# Altium schematic sheet core.SchDoc
size A4
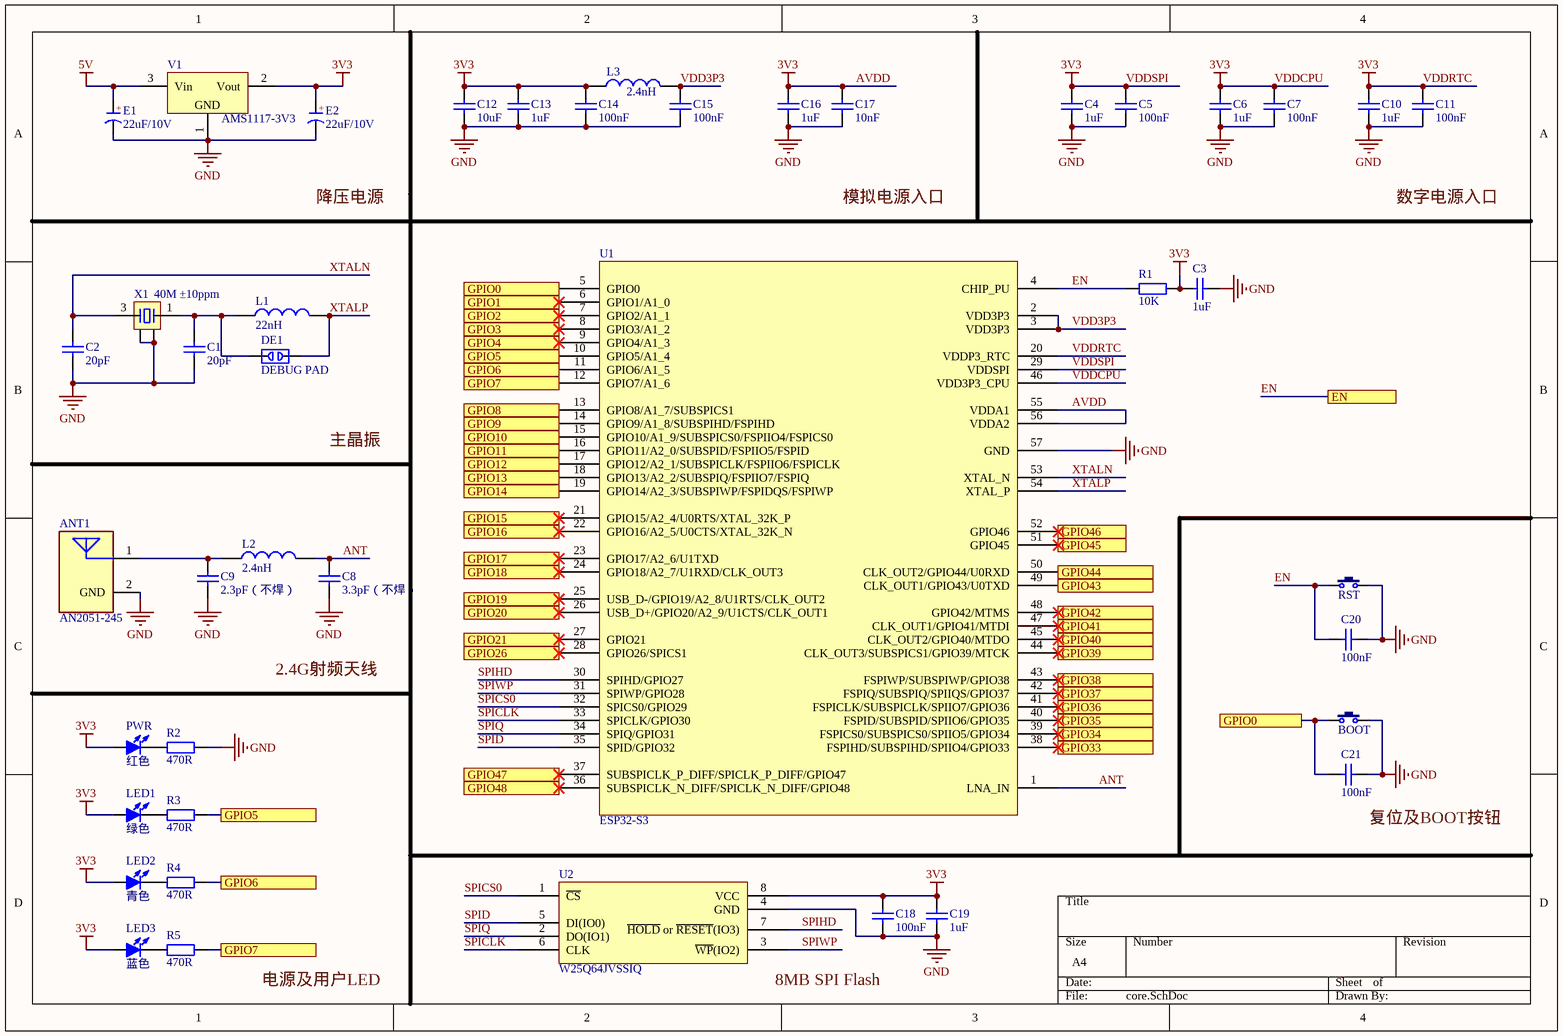
[diagram p0: core.SchDoc]

## Parts
ANT1  AN2051-245  [SMD-2051]
BOOT  3x6x5  [TSW SMD-3*6*2.5]  (value not drawn)
C1  20pF  [C 0603_L]
C2  20pF  [C 0603_L]
C3  1uF  [C 0603_L]
C4  1uF  [C 0603_L]
C5  100nF  [C 0603_L]
C6  1uF  [C 0603_L]
C7  100nF  [C 0603_L]
C8  3.3pF（不焊）  [C 0402_L]
C9  2.3pF（不焊）  [C 0402_L]
C10  1uF  [C 0603_L]
C11  100nF  [C 0603_L]
C12  10uF  [C 0603_L]
C13  1uF  [C 0603_L]
C14  100nF  [C 0603_L]
C15  100nF  [C 0603_L]
C16  1uF  [C 0603_L]
C17  10nF  [C 0603_L]
C18  100nF  [C 0603_L]
C19  1uF  [C 0603_L]
C20  100nF  [C 0603_L]
C21  100nF  [C 0603_L]
DE1  DEBUG PAD  [DEBUG_A]
E1  22uF/10V  [CD A(3216)]
E2  22uF/10V  [CD A(3216)]
L1  22nH  [L 0603]
L2  2.4nH  [L 0402]
L3  2.4nH  [L 0402]
LED1  绿色  [LED 0603B]
LED2  青色  [LED 0603B]
LED3  蓝色  [LED 0603B]
PWR  红色  [LED 0603B]
R1  10K  [R 0603_L]
R2  470R  [R 0603_L]
R3  470R  [R 0603_L]
R4  470R  [R 0603_L]
R5  470R  [R 0603_L]
RST  3x6x5  [TSW SMD-3*6*2.5]  (value not drawn)
U1  ESP32-S3  [QFN56 7x7]
U2  W25Q64JVSSIQ  [SOIC-8W]
V1  AMS1117-3V3  [SOT223_L]
X1  40M ±10ppm  [OSC 2025-4P]

## Ports
EN, GPIO0, GPIO1, GPIO2, GPIO3, GPIO4, GPIO5, GPIO6, GPIO7, GPIO8, GPIO9, GPIO10, GPIO11, GPIO12, GPIO13, GPIO14, GPIO15, GPIO16, GPIO17, GPIO18, GPIO19, GPIO20, GPIO21, GPIO26, GPIO33, GPIO34, GPIO35, GPIO36, GPIO37, GPIO38, GPIO39, GPIO40, GPIO41, GPIO42, GPIO43, GPIO44, GPIO45, GPIO46, GPIO47, GPIO48

## Nets
5V: E1.1(A) V1.3(Vin)
AVDD: C3.2 C4.1 C5.1 C6.1 C7.1 C10.1 C11.1 C12.1 C13.1 C14.1 C16.1 C17.1 C18.1 C19.1 E2.1(A) L3.1 LED1.1(A) LED2.1(A) LED3.1(A) PWR.1(A) R1.2 U1.20(VDDP3_RTC) U1.29(VDDSPI) U1.46(VDD3P3_CPU) U1.55(VDDA1) U1.56(VDDA2) U2.8(VCC) V1.2(Vout)  [also labelled 3V3, VDDCPU, VDDRTC, VDDSPI]
GND: ANT1.2(GND) BOOT.2 C1.1 C2.1 C3.1 C4.2 C5.2 C6.2 C7.2 C8.1 C9.1 C10.2 C11.2 C12.2 C13.2 C14.2 C15.2 C16.2 C17.2 C18.2 C19.2 C20.1 C21.1 E1.2(K) E2.2(K) R2.2 RST.2 U1.57(GND) U2.4(GND) V1.1(GND) X1.2 X1.4
ANT: C8.2 L2.1 U1.1(LNA_IN)
EN: C20.2 R1.1 RST.1 U1.4(CHIP_PU) ; port EN
GPIO0: BOOT.1 C21.2 U1.5(GPIO0) ; port GPIO0
GPIO1: U1.6(GPIO1/A1_0) ; port GPIO1
GPIO2: U1.7(GPIO2/A1_1) ; port GPIO2
GPIO3: U1.8(GPIO3/A1_2) ; port GPIO3
GPIO4: U1.9(GPIO4/A1_3) ; port GPIO4
GPIO5: R3.2 U1.10(GPIO5/A1_4) ; port GPIO5
GPIO6: R4.2 U1.11(GPIO6/A1_5) ; port GPIO6
GPIO7: R5.2 U1.12(GPIO7/A1_6) ; port GPIO7
GPIO8: U1.13(GPIO8/A1_7/SUBSPICS1) ; port GPIO8
GPIO9: U1.14(GPIO9/A1_8/SUBSPIHD/FSPIHD) ; port GPIO9
GPIO10: U1.15(GPIO10/A1_9/SUBSPICS0/FSPIIO4/FSPICS0) ; port GPIO10
GPIO11: U1.16(GPIO11/A2_0/SUBSPID/FSPIIO5/FSPID) ; port GPIO11
GPIO12: U1.17(GPIO12/A2_1/SUBSPICLK/FSPIIO6/FSPICLK) ; port GPIO12
GPIO13: U1.18(GPIO13/A2_2/SUBSPIQ/FSPIIO7/FSPIQ) ; port GPIO13
GPIO14: U1.19(GPIO14/A2_3/SUBSPIWP/FSPIDQS/FSPIWP) ; port GPIO14
GPIO15: U1.21(GPIO15/A2_4/U0RTS/XTAL_32K_P) ; port GPIO15
GPIO16: U1.22(GPIO16/A2_5/U0CTS/XTAL_32K_N) ; port GPIO16
GPIO17: U1.23(GPIO17/A2_6/U1TXD) ; port GPIO17
GPIO18: U1.24(GPIO18/A2_7/U1RXD/CLK_OUT3) ; port GPIO18
GPIO19: U1.25(USB_D-/GPIO19/A2_8/U1RTS/CLK_OUT2) ; port GPIO19
GPIO20: U1.26(USB_D+/GPIO20/A2_9/U1CTS/CLK_OUT1) ; port GPIO20
GPIO21: U1.27(GPIO21) ; port GPIO21
GPIO26: U1.28(GPIO26/SPICS1) ; port GPIO26
GPIO33: U1.38(FSPIHD/SUBSPIHD/SPIIO4/GPIO33) ; port GPIO33
GPIO34: U1.39(FSPICS0/SUBSPICS0/SPIIO5/GPIO34) ; port GPIO34
GPIO35: U1.40(FSPID/SUBSPID/SPIIO6/GPIO35) ; port GPIO35
GPIO36: U1.41(FSPICLK/SUBSPICLK/SPIIO7/GPIO36) ; port GPIO36
GPIO37: U1.42(FSPIQ/SUBSPIQ/SPIIQS/GPIO37) ; port GPIO37
GPIO38: U1.43(FSPIWP/SUBSPIWP/GPIO38) ; port GPIO38
GPIO39: U1.44(CLK_OUT3/SUBSPICS1/GPIO39/MTCK) ; port GPIO39
GPIO40: U1.45(CLK_OUT2/GPIO40/MTDO) ; port GPIO40
GPIO41: U1.47(CLK_OUT1/GPIO41/MTDI) ; port GPIO41
GPIO42: U1.48(GPIO42/MTMS) ; port GPIO42
GPIO43: U1.49(CLK_OUT1/GPIO43/U0TXD) ; port GPIO43
GPIO44: U1.50(CLK_OUT2/GPIO44/U0RXD) ; port GPIO44
GPIO45: U1.51(GPIO45) ; port GPIO45
GPIO46: U1.52(GPIO46) ; port GPIO46
GPIO47: U1.37(SUBSPICLK_P_DIFF/SPICLK_P_DIFF/GPIO47) ; port GPIO47
GPIO48: U1.36(SUBSPICLK_N_DIFF/SPICLK_N_DIFF/GPIO48) ; port GPIO48
SPICLK: U1.33(SPICLK/GPIO30) U2.6(CLK)
SPICS0: U1.32(SPICS0/GPIO29) U2.1(~{CS})
SPID: U1.35(SPID/GPIO32) U2.5(DI(IO0))
SPIHD: U1.30(SPIHD/GPIO27) U2.7(~{HOLD}_or_~{RESET}(IO3))
SPIQ: U1.34(SPIQ/GPIO31) U2.2(DO(IO1))
SPIWP: U1.31(SPIWP/GPIO28) U2.3(~{WP}(IO2))
VDD3P3: C15.1 L3.2 U1.2(VDD3P3) U1.3(VDD3P3)
XTALN: C2.2 U1.53(XTAL_N) X1.3
XTALP: DE1.1 L1.1 U1.54(XTAL_P)
NetANT1_1: ANT1.1(FT) C9.2 L2.2
NetC1_2: C1.2 DE1.2 L1.2 X1.1
NetLED1_2: LED1.2(K) R3.1
NetLED2_2: LED2.2(K) R4.1
NetLED3_2: LED3.2(K) R5.1
NetPWR_2: PWR.2(K) R2.1

## Notes on the sheet
- 降压电源
- 模拟电源入口
- 数字电源入口
- 主晶振
- 2.4G射频天线
- (near C21) 复位及BOOT按钮
- 电源及用户LED
- 8MB SPI Flash
- (in symbol CT) +

## Library data of the parts
ANT1 = AN2051: AN2051 多层贴片天线 2.45GHz @110Mhz带宽 50ohm阻抗
BOOT RST = TSW 3x6: 3x6轻触开关; 免费技术支持，联系售后: 唯一出售店铺网址https://shop463601444.taobao.com; 封装库来自淘宝卖家 ID：黄晶宝石: 其他店铺购入均为盗版假冒封装库，请立即申请退款，本店3~10元现金奖励; BOM名称: 3x6轻触开关
C1-C7 C10-C21 = C: 贴片电容; BOM名称: 无极性贴片电容; 优秀评价可免费更新: 联系淘宝ID：黄晶宝石，获取更新版封装库; 本封装库来自淘宝卖家 ID：黄晶宝石: 其他店铺购入均为盗版，请立即申请退款; 联系卖家，免费查找封装: 唯一出售店铺网址https://shop463601444.taobao.com
C8 C9 = C-Precision: 精密电容
DE1 = DEBUG: 调试断点焊盘; 封装库来自淘宝卖家 ID：黄晶宝石: 其他店铺购入均为盗版，请立即申请退款，本店提供现金奖励; 免费技术支持，联系售后: 唯一出售店铺网址https://shop463601444.taobao.com; BOM名称: 调试断点焊盘
E1 E2 = CT: 贴片钽电容; 优秀评价可免费更新: 联系淘宝ID：黄晶宝石，获取更新版封装库; 本封装库来自淘宝卖家 ID：黄晶宝石: 其他店铺购入均为盗版，请立即申请退款; 联系卖家，免费查找封装: 唯一出售店铺网址https://shop463601444.taobao.com; BOM名称: 贴片钽电容
L1-L3 = L: 小功率贴片电感; 优秀评价可免费更新: 联系淘宝ID：黄晶宝石，获取更新版封装库; 本封装库来自淘宝卖家 ID：黄晶宝石: 其他店铺购入均为盗版，请立即申请退款; 联系卖家，免费查找封装: 唯一出售店铺网址https://shop463601444.taobao.com; BOM名称: 小功率贴片电感
LED1-LED3 PWR = LED-SMD: 贴片LED; 封装库来自淘宝卖家 ID：黄晶宝石: 其他店铺购入均为假冒，请立即申请退款，本店奖励2~5元现金; 卖家免费查找封装，联系售后: 唯一出售店铺网址https://shop463601444.taobao.com; BOM名称: 贴片LED
R1-R5 = R: 贴片电阻; 优秀评价可免费更新: 联系淘宝ID：黄晶宝石，获取更新版封装库; 本封装库来自淘宝卖家 ID：黄晶宝石: 其他店铺购入均为盗版，请立即申请退款; 联系卖家，免费查找封装: 唯一出售店铺网址https://shop463601444.taobao.com; BOM名称: 贴片电阻
U1 = ESP32-S3: 2.4 GHz Wi­Fi + 低功耗蓝牙 SoC
U2 = W25Q64: 8MB SPI Flash存储器
V1 = AMS1117: 三端稳压芯片; BOM名称: 稳压芯片; 卖家免费技术支持，联系售后: 唯一出售店铺网址https://shop463601444.taobao.com; 封装库来自淘宝卖家 ID：黄晶宝石: 其他店铺购入均为假冒，请立即申请退款，本店奖励2~5元现金; 卖家免费查找封装，联系售后: 唯一出售店铺网址https://shop463601444.taobao.com
X1 = XTAL-4P: 4脚无源晶振; 版权归属: 封装库来自淘宝卖家 ID：黄晶宝石; 优秀评价可免费更新: 联系淘宝ID：黄晶宝石，获取更新版封装库; 卖家免费技术支持，联系售后: 唯一出售店铺网址https://shop463601444.taobao.com; 封装库来自淘宝卖家 ID：黄晶宝石: 其他店铺购入均为盗版，请立即申请退款; BOM名称: 4脚无源晶振